# Altium schematic sheet cSLIM_display.SchDoc
size 297 x 210 mm; SheetNumber: 9
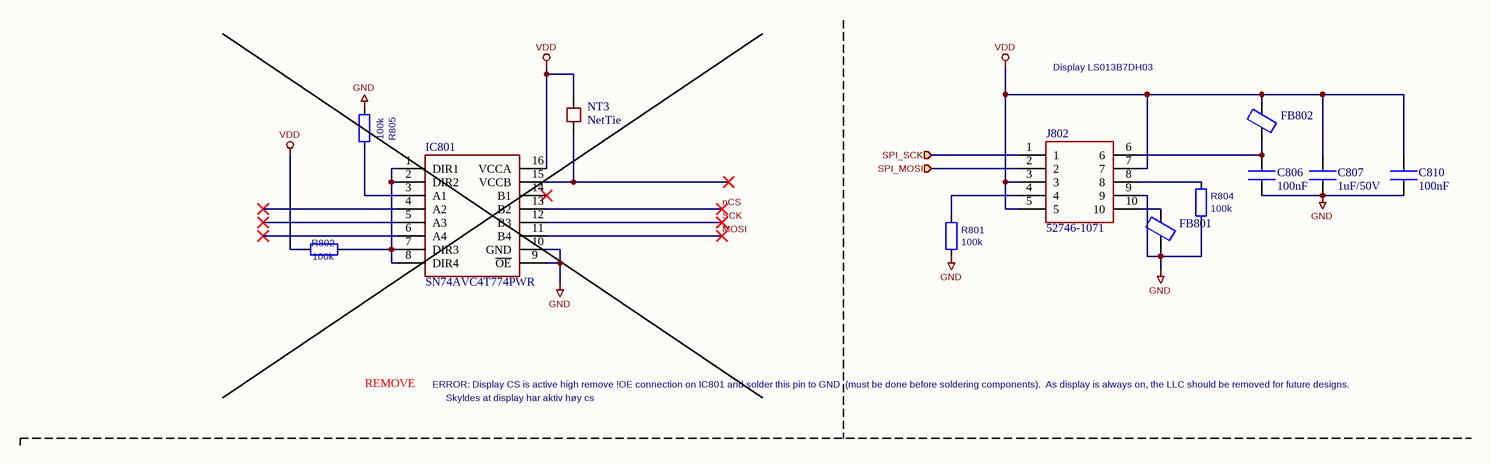
[diagram p0: cSLIM_display.SchDoc]

## Parts
C806  100nF  [CAPC1608X90N]
C807  1uF/50V  [CAPC1608X90N]
C810  100nF  [CAPC1608X90N]
FB801  Ferrite_Bead  [CAPC1608X90N]  (value not drawn)
FB802  Ferrite_Bead  [CAPC1608X90N]  (value not drawn)
IC801  SN74AVC4T774PWR  [SOP65P640X120-16N]
J802  52746-1071  [52746-1071]
NT3  NetTie  [NETTIE_FP]
R801  100k  [RESC1608X55N]
R802  100k  [R_0805_2012Metric]
R804  100k  [RESC1608X55N]
R805  100k  [R_0805_2012Metric]

## Ports
SPI_MOSI (in), SPI_SCK (in)

## Nets
GND: C806.2 C807.2 C810.2 FB801.2 IC801.9(~{OE}) IC801.10(GND) J802.9 R801.2 R804.2 R805.2
VDD: C807.1 C810.1 FB802.1 IC801.16(VCCA) J802.3 J802.5 J802.7 R802.2
MOSI: IC801.11(B4)
nCS: IC801.13(B2)
SCK: IC801.12(B3)
SPI_MOSI: J802.2 ; port SPI_MOSI
SPI_SCK: J802.1 ; port SPI_SCK
NetC806_1: C806.1 FB802.2 J802.6
NetFB801_1: FB801.1 J802.10
NetIC801_1: IC801.1(DIR1) IC801.2(DIR2) IC801.7(DIR3) IC801.8(DIR4) R802.1
NetIC801_3: IC801.3(A1) R805.1
NetJ802_4: J802.4 R801.1
NetJ802_8: J802.8 R804.1

Not connected (* = marked no-connect by the designer): IC801 4(A2)* 5(A3)* 6(A4)* 14(B1)* 15(VCCB)*; NT3 1 2

## Notes on the sheet
- Display
  LS013B7DH03
- REMOVE
- ERROR: Display CS is active high
  remove !OE connection on IC801 and solder this pin to GND
  (must be done before soldering components).
  As display is always on, the LLC should be removed for future designs.
- Skyldes at display har aktiv høy cs
- 1
- 2
- 3
- 4
- 5
- 6
- A
- B
- C
- Eivind Jølsgard
- D
- Title: cSLIM Display
- File: cSLIM_display.sch
- Sheet: /
- NTNU
- KiCad E.D.A.  kicad (5.1.4)-1
- Size: A4
- Date: 2021-06-30
- Rev: v1.1
- Id: 8/11

## Library data of the parts
C806 C807 C810 = C: Capacitor; Manufacturer_Name: AVX; Manufacturer_Part_Number: 06033G104ZAT2A; Datasheet Link: http://www.mouser.com/catalog/supplier/library/pdf/AVXSurfaceMountCeramic.pdf; Height: 0.9mm; Mouser Part Number: 581-06033G104Z; Mouser Price/Stock: https://www.mouser.co.uk/ProductDetail/AVX/06033G104ZAT2A?qs=NXubJDmysXJMPmHfVo6Z%252BA%3D%3D; Arrow Part Number: 06033G104ZAT2A; Arrow Price/Stock: https://www.arrow.com/en/products/06033g104zat2a/avx?region=nac
IC801 = SN74AVC4T774PWR: Integrated Circuit; Manufacturer_Name: Texas Instruments; Datasheet Link: http://www.ti.com/lit/gpn/sn74avc4t774; Height: 1.2mm; Manufacturer_Part_Number: SN74AVC4T774PWR; Mouser Part Number: 595-SN74AVC4T774PWR; Mouser Price/Stock: https://www.mouser.co.uk/ProductDetail/Texas-Instruments/SN74AVC4T774PWR?qs=WxL8HmPi5r562Eu%2F2kE2LA%3D%3D; Arrow Part Number: SN74AVC4T774PWR; Arrow Price/Stock: https://www.arrow.com/en/products/sn74avc4t774pwr/texas-instruments?region=nac
J802 = 52746-1071: Connector; Manufacturer_Name: Molex; Datasheet Link: http://www.molex.com/pdm_docs/sd/527461071_sd.pdf; Manufacturer_Part_Number: 52746-1071; Mouser Part Number: 538-52746-1071; Mouser Price/Stock: https://www.mouser.co.uk/ProductDetail/Molex/52746-1071?qs=gi08C7HaimYPHJccIEZoxg%3D%3D
R801 R802 R804 R805 = R: Value: 100k
  R802 R805: Footprint: Resistor_SMD:R_0805_2012Metric